# Altium project pay-motors-control.PrjPCB
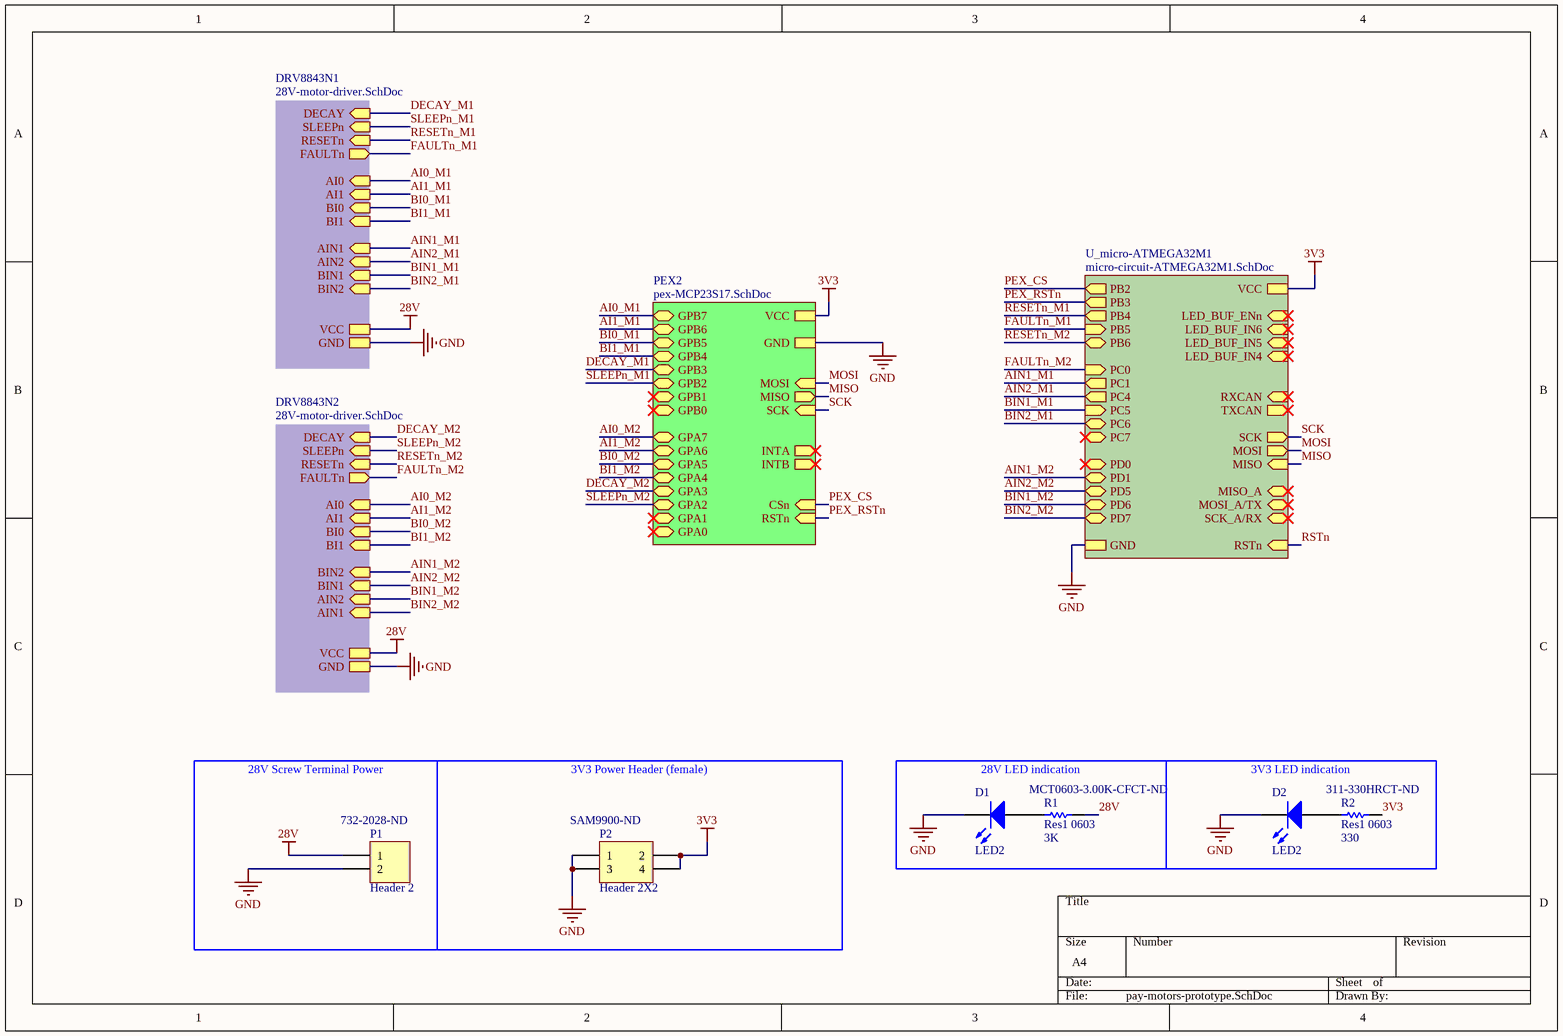
[diagram p0: pay-motors-prototype.SchDoc]
2 sheets, 42 parts. Net scope: hierarchical (ports join the sheet entries above them; power ports are global).
Board file: pay-motors-prototype.PcbDoc
Sheets:
  pay-motors-prototype.SchDoc
    DRV8843N1 = 28V-motor-driver.SchDoc
    DRV8843N2 = 28V-motor-driver.SchDoc

## Sheet pay-motors-prototype.SchDoc
size A4; DrawnBy: Lorna Lan; DocumentNumber: 1; Revision: V1; SheetNumber: 1; SheetTotal: 7

### Parts
D1  LED2  [0603-LED]
D2  LED2  [0603-LED]
P1  Header 2  Supplier Part Number 1: 732-2028-ND  [CON2_SCREW_5.00MM_691102710002]
P2  Header 2X2  Supplier Part Number 1: SAM9900-ND  [HDR2X2]
R1  Res1 0603  value 3K  Supplier Part Number 1: MCT0603-3.00K-CFCT-ND  [0603-RES]
R2  Res1 0603  value 330  Supplier Part Number 1: 311-330HRCT-ND  [0603-RES]

### Sub-sheets
DRV8843N1 = 28V-motor-driver.SchDoc: DECAY (in), GND, SLEEPn (in), BI1 (in), BI0 (in), RESETn (in), VCC, FAULTn (out), AI1 (in), AI0 (in), BIN2 (in), BIN1 (in), AIN2 (in), AIN1 (in)
DRV8843N2 = 28V-motor-driver.SchDoc: DECAY (in), GND, SLEEPn (in), BI1 (in), BI0 (in), RESETn (in), VCC, FAULTn (out), AI1 (in), AI0 (in), BIN2 (in), BIN1 (in), AIN2 (in), AIN1 (in)
PEX2 = pex-MCP23S17.SchDoc (file not in this document): RSTn (in), GPA0 (bidir), GPA6 (bidir), GPA1 (bidir), GPB2 (bidir), INTB (out), GPB1 (bidir), GPB3 (bidir), GPA5 (bidir), GND, GPA7 (bidir), GPB7 (bidir), MISO (out), GPB4 (bidir), INTA (out), GPB6 (bidir), GPA2 (bidir), VCC, GPA3 (bidir), GPB0 (bidir), MOSI (in), SCK (in), GPA4 (bidir), GPB5 (bidir), CSn (in)
U_micro-ATMEGA32M1 = micro-circuit-ATMEGA32M1.SchDoc (file not in this document): LED_BUF_IN6 (in), LED_BUF_IN5 (in), LED_BUF_IN4 (in), LED_BUF_ENn (in), PB5 (in), MOSI_A/TX (bidir), PB2 (out), MISO_A (bidir), RXCAN (in), TXCAN (out), PC0 (in), PB3 (out), PC1 (out), PC4 (out), PC5 (in), PC6 (bidir), PC7 (bidir), PD1 (bidir), PD5 (bidir), PD6 (bidir), PD7 (bidir), PD0 (bidir), PB4 (out), SCK (out), SCK_A/RX (bidir), MISO (in), MOSI (out), PB6 (bidir), RSTn (in), GND, VCC

### Nets
3V3: P2.2 P2.4 R2.2 ; sheet U_micro-ATMEGA32M1/VCC, sheet PEX2/VCC
28V: P1.1 R1.2 ; sheet DRV8843N1/VCC, sheet DRV8843N2/VCC
GND: D1.2(K) D2.2(K) P1.2 P2.1 P2.3 ; sheet U_micro-ATMEGA32M1/GND, sheet PEX2/GND, sheet DRV8843N1/GND, sheet DRV8843N2/GND
AI0_M1: sheet PEX2/GPB7, sheet DRV8843N1/AI0  [project net AI0_DRV8843N1]
AI0_M2: sheet PEX2/GPA7, sheet DRV8843N2/AI0  [project net AI0_DRV8843N2]
AI1_M1: sheet PEX2/GPB6, sheet DRV8843N1/AI1  [project net AI1_DRV8843N1]
AI1_M2: sheet PEX2/GPA6, sheet DRV8843N2/AI1  [project net AI1_DRV8843N2]
AIN1_M1: sheet U_micro-ATMEGA32M1/PC1, sheet DRV8843N1/AIN1  [project net AIN1_DRV8843N1]
AIN1_M2: sheet U_micro-ATMEGA32M1/PD1, sheet DRV8843N2/BIN2
AIN2_M1: sheet U_micro-ATMEGA32M1/PC4, sheet DRV8843N1/AIN2  [project net AIN2_DRV8843N1]
AIN2_M2: sheet U_micro-ATMEGA32M1/PD5, sheet DRV8843N2/BIN1
BI0_M1: sheet PEX2/GPB5, sheet DRV8843N1/BI0  [project net BI0_DRV8843N1]
BI0_M2: sheet PEX2/GPA5, sheet DRV8843N2/BI0  [project net BI0_DRV8843N2]
BI1_M1: sheet PEX2/GPB4, sheet DRV8843N1/BI1  [project net BI1_DRV8843N1]
BI1_M2: sheet PEX2/GPA4, sheet DRV8843N2/BI1  [project net BI1_DRV8843N2]
BIN1_M1: sheet U_micro-ATMEGA32M1/PC5, sheet DRV8843N1/BIN1  [project net BIN1_DRV8843N1]
BIN1_M2: sheet U_micro-ATMEGA32M1/PD6, sheet DRV8843N2/AIN2  [project net AIN2_DRV8843N2]
BIN2_M1: sheet U_micro-ATMEGA32M1/PC6, sheet DRV8843N1/BIN2  [project net BIN2_DRV8843N1]
BIN2_M2: sheet U_micro-ATMEGA32M1/PD7, sheet DRV8843N2/AIN1  [project net AIN1_DRV8843N2]
DECAY_M1: sheet PEX2/GPB3, sheet DRV8843N1/DECAY  [project net DECAY_DRV8843N1]
DECAY_M2: sheet PEX2/GPA3, sheet DRV8843N2/DECAY  [project net DECAY_DRV8843N2]
FAULTn_M1: sheet U_micro-ATMEGA32M1/PB5, sheet DRV8843N1/FAULTn  [project net FAULTn_DRV8843N1]
FAULTn_M2: sheet U_micro-ATMEGA32M1/PC0, sheet DRV8843N2/FAULTn  [project net FAULTn_DRV8843N2]
MISO: sheet U_micro-ATMEGA32M1/MISO, sheet PEX2/MISO
MOSI: sheet U_micro-ATMEGA32M1/MOSI, sheet PEX2/MOSI
PEX_CS: sheet U_micro-ATMEGA32M1/PB2, sheet PEX2/CSn
PEX_RSTn: sheet U_micro-ATMEGA32M1/PB3, sheet PEX2/RSTn
RESETn_M1: sheet U_micro-ATMEGA32M1/PB4, sheet DRV8843N1/RESETn  [project net RESETn_DRV8843N1]
RESETn_M2: sheet U_micro-ATMEGA32M1/PB6, sheet DRV8843N2/RESETn  [project net RESETn_DRV8843N2]
RSTn: sheet U_micro-ATMEGA32M1/RSTn
SCK: sheet U_micro-ATMEGA32M1/SCK, sheet PEX2/SCK
SLEEPn_M1: sheet PEX2/GPB2, sheet DRV8843N1/SLEEPn  [project net SLEEPn_DRV8843N1]
SLEEPn_M2: sheet PEX2/GPA2, sheet DRV8843N2/SLEEPn  [project net SLEEPn_DRV8843N2]
NetD1_1: D1.1(A) R1.1
NetD2_1: D2.1(A) R2.1

### Notes on the sheet
- 28V LED indication
- 3V3 LED indication
- (near P1) 28V Screw Terminal Power
- (near P2) 3V3 Power Header (female)

### Library data of the parts
D1 D2 = LED2: Typical RED, GREEN, YELLOW, AMBER GaAs LED; Published: 8-Jun-2000; LatestRevisionDate: 17-Jul-2002; LatestRevisionNote: Re-released for DXP Platform.; PackageVersion: Feb-2002; PackageReference: 3.2X1.6X1.1; Publisher: Altium Limited; PackageDescription: SM LED; 2 Flat Leads
P1 = Header 2: Header, 2-Pin; LatestRevisionDate: 17-Jul-2002; LatestRevisionNote: Re-released for DXP Platform.; Publisher: Altium Limited; Supplier 1: Digi-Key
P2 = Header 2X2: Header, 2-Pin, Dual row; LatestRevisionDate: 17-Jul-2002; LatestRevisionNote: Re-released for DXP Platform.; Publisher: Altium Limited; Supplier 1: Digi-Key
R1 R2 = Res1: Resistor; Published: 8-Jun-2000; LatestRevisionDate: 17-Jul-2002; LatestRevisionNote: Re-released for DXP Platform.; Publisher: Altium Limited; Supplier 1: Digi-Key
  R2: PackageReference: AXIAL-0.3; PackageDescription: Axial Device, Thru-Hole; 2 Leads; 0.3 in Pin Spacing; ComponentLink1Description: Digikey Link; ComponentLink1URL: https://www.digikey.ca/product-detail/en/yageo/RC0603FR-07330RL/311-330HRCT-ND/730109

## Sheet 28V-motor-driver.SchDoc
size A4; DrawnBy: Lorna Lan; DocumentNumber: 3; Revision: V1; SheetNumber: 4; SheetTotal: 7
Used 2 times, as channels DRV8843N1, DRV8843N2. Parts and nets are listed once, with the designators drawn on the sheet.
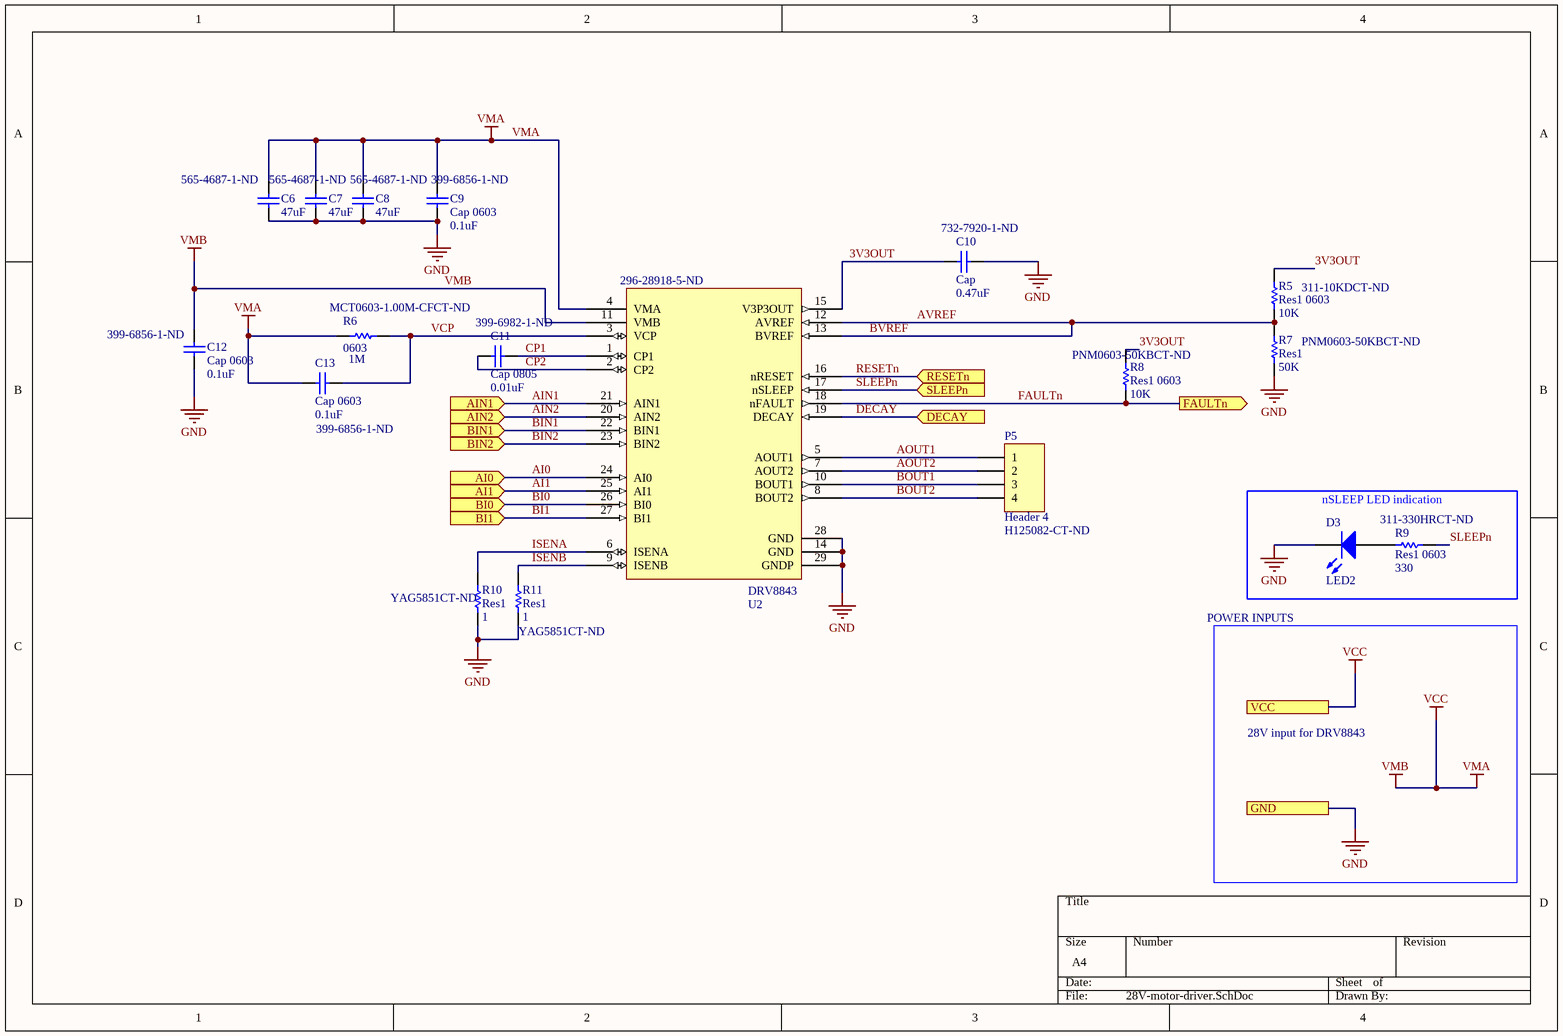
[diagram p1: 28V-motor-driver.SchDoc]

### Parts
C6  47uF  Supplier Part Number 1: 565-4687-1-ND  [CAP-2 J-lead]
C7  47uF  Supplier Part Number 1: 565-4687-1-ND  [CAP-2 J-lead]
C8  47uF  Supplier Part Number 1: 565-4687-1-ND  [CAP-2 J-lead]
C9  Cap 0603  value 0.1uF  Supplier Part Number 1: 399-6856-1-ND  [0603-RES]
C10  Cap  value 0.47uF  Supplier Part Number 1: 732-7920-1-ND  [0603-RES]
C11  Cap 0805  value 0.01uF  Supplier Part Number 2: 399-6982-1-ND  [6-0805_M]
C12  Cap 0603  value 0.1uF  Supplier Part Number 1: 399-6856-1-ND  [0603-RES]
C13  Cap 0603  value 0.1uF  Supplier Part Number 1: 399-6856-1-ND  [0603-RES]
D3  LED2  [0603-LED]
P5  Header 4  Supplier Part Number 1: H125082-CT-ND  [DF13A-4P-1.25H(51)]
R5  Res1 0603  value 10K  Supplier Part Number 1: 311-10KDCT-ND  [0603-RES]
R6  0603  value 1M  Supplier Part Number 1: MCT0603-1.00M-CFCT-ND  [0603-RES]
R7  Res1  value 50K  Supplier Part Number 1: PNM0603-50KBCT-ND  [0603-RES]
R8  Res1 0603  value 10K  Supplier Part Number 1: PNM0603-50KBCT-ND  [0603-RES]
R9  Res1 0603  value 330  Supplier Part Number 1: 311-330HRCT-ND  [0603-RES]
R10  Res1  value 1  Supplier Part Number 1: YAG5851CT-ND  [6-0805_M]
R11  Res1  value 1  Supplier Part Number 1: YAG5851CT-ND  [6-0805_M]
U2  DRV8843  Supplier Part Number 1: 296-28918-5-ND  [SOP65P640X110-29N]

### Ports
AI0 (in), AI1 (in), AIN1 (in), AIN2 (in), BI0 (in), BI1 (in), BIN1 (in), BIN2 (in), DECAY (in), FAULTn (out), GND, RESETn (in), SLEEPn (in), VCC

### Nets
GND: C6.2 C7.2 C8.2 C9.2 C10.2 C12.2 D3.2(K) R7.1 R10.2 R11.2 U2.14(GND) U2.28(GND) U2.29(GNDP) ; port GND
VMA: C6.1 C7.1 C8.1 C9.1 C12.1 C13.1 R6.1 U2.4(VMA) U2.11(VMB) ; port VCC  [also labelled VCC, VMB]
3V3OUT: C10.1 R5.2 R8.2 U2.15(V3P3OUT)
AI0: U2.24(AI0) ; port AI0
AI1: U2.25(AI1) ; port AI1
AIN1: U2.21(AIN1) ; port AIN1
AIN2: U2.20(AIN2) ; port AIN2
AOUT1: P5.1 U2.5(AOUT1)
AOUT2: P5.2 U2.7(AOUT2)
AVREF: R5.1 R7.2 U2.12(AVREF) U2.13(BVREF)  [also labelled BVREF]
BI0: U2.26(BI0) ; port BI0
BI1: U2.27(BI1) ; port BI1
BIN1: U2.22(BIN1) ; port BIN1
BIN2: U2.23(BIN2) ; port BIN2
BOUT1: P5.3 U2.10(BOUT1)
BOUT2: P5.4 U2.8(BOUT2)
CP1: C11.1 U2.1(CP1)
CP2: C11.2 U2.2(CP2)
DECAY: U2.19(DECAY) ; port DECAY
FAULTn: R8.1 U2.18(nFAULT) ; port FAULTn
ISENA: R10.1 U2.6(ISENA)
ISENB: R11.1 U2.9(ISENB)
RESETn: U2.16(nRESET) ; port RESETn
SLEEPn: R9.2 U2.17(nSLEEP) ; port SLEEPn
VCP: C13.2 R6.2 U2.3(VCP)
NetD3_1: D3.1(A) R9.1

### Channels
DRV8843N1: designators C6=BYPASS2 C7=C7_DRV8843N1 C8=C8_DRV8843N1 C9=C9#1 C10=C10#1 C11=C11#1 C12=C12#1 C13=C13#1 D3=M1_EN P5=M1 R5=R5#1 R6=R6#1 R7=R7#1 R8=R8#1 R9=R9#1 R10=ISENA#1 R11=ISENB#1 U2=DRV8843#1; ports AI0=AI0_DRV8843N1 AI1=AI1_DRV8843N1 AIN1=AIN1_DRV8843N1 AIN2=AIN2_DRV8843N1 BI0=BI0_DRV8843N1 BI1=BI1_DRV8843N1 BIN1=BIN1_DRV8843N1 BIN2=BIN2_DRV8843N1 DECAY=DECAY_DRV8843N1 FAULTn=FAULTn_DRV8843N1 GND=GND RESETn=RESETn_DRV8843N1 SLEEPn=SLEEPn_DRV8843N1 VCC=28V
DRV8843N2: designators C6=C6_DRV8843N2 C7=BYPASS3 C8=BYPASS1 C9=C9#2 C10=C10#2 C11=C11#2 C12=C12#2 C13=C13#2 D3=M2_EN P5=M2 R5=R5#2 R6=R6#2 R7=R7#2 R8=R8#2 R9=R9#2 R10=ISENA#2 R11=ISENB#2 U2=DRV8843#2; ports AI0=AI0_DRV8843N2 AI1=AI1_DRV8843N2 AIN1=AIN1_DRV8843N2 AIN2=AIN2_DRV8843N2 BI0=BI0_DRV8843N2 BI1=BI1_DRV8843N2 BIN1=AIN2_M2 BIN2=AIN1_M2 DECAY=DECAY_DRV8843N2 FAULTn=FAULTn_DRV8843N2 GND=GND RESETn=RESETn_DRV8843N2 SLEEPn=SLEEPn_DRV8843N2 VCC=28V

### Notes on the sheet
- POWER INPUTS
- nSLEEP LED indication
- 28V input for DRV8843

### Library data of the parts
C6-C8 = Cap: 47µF ±20% 50V Ceramic Capacitor X7R Stacked SMD, 2 J-Lead; Published: 8-Jun-2000; LatestRevisionDate: 17-Jul-2002; LatestRevisionNote: Re-released for DXP Platform.; PackageReference: RAD-0.3; Publisher: Altium Limited; PackageDescription: Radial Cap, Thru-Hole; 2 Leads; 0.3 in Pin Spacing; Value: 47uF; ComponentLink1Description: Digikey Link; ComponentLink1URL: https://www.digikey.ca/product-detail/en/united-chemi-con/KTJ500B476M76BFT00/565-4687-1-ND/6210741; Supplier 1: Digi-Key
C9 C12 C13 = Cap: Capacitor; Published: 8-Jun-2000; LatestRevisionDate: 17-Jul-2002; LatestRevisionNote: Re-released for DXP Platform.; PackageReference: RAD-0.3; Publisher: Altium Limited; PackageDescription: Radial Cap, Thru-Hole; 2 Leads; 0.3 in Pin Spacing; Supplier 1: Digi-Key
  C9 C12: ComponentLink1Description: Digikey Link; ComponentLink1URL: https://www.digikey.ca/product-detail/en/yageo/CC0603ZRY5V9BB104/311-1343-1-ND/2103127
C10 = Cap: Capacitor; Capacitance: 470nF; Voltage Rating: 6.3V; Tolerance: 10%; Published: 8-Jun-2000; LatestRevisionDate: 17-Jul-2002; LatestRevisionNote: Re-released for DXP Platform.; PackageReference: RAD-0.3; Publisher: Altium Limited; PackageDescription: Radial Cap, Thru-Hole; 2 Leads; 0.3 in Pin Spacing; Mount: Surface Mount; Case/Package: 0603; Case Code (Metric): 1608; Case Code (Imperial): 0603; Min Operating Temperature: -55°C; Max Operating Temperature: 125°C; Length: 0.063inch; Width: 0.031inch; Thickness: 0.037inch; Supplier 1: Digi-Key
C11 = Cap: Capacitor; Manufacturer: KEMET; Manufacturer Part Number: C0805F103K5RACAUTO; Dielectric Material: Ceramic; Capacitance: 10nF; Voltage Rating: 50V; Tolerance: 10%; Dielectric: X7R; Published: 8-Jun-2000; LatestRevisionDate: 17-Jul-2002; LatestRevisionNote: Re-released for DXP Platform.; PackageReference: RAD-0.3; Publisher: Altium Limited; PackageDescription: Radial Cap, Thru-Hole; 2 Leads; 0.3 in Pin Spacing; ComponentLink1Description: Digikey Link; ComponentLink1URL: https://www.digikey.ca/product-detail/en/yageo/CC0805KRX7R9BB103/311-1136-1-ND/303046; Supplier 1: Digi-Key; Supplier 2: Digi-Key; Stock 2: 15954; Pricing 2: 1=0.42, 10=0.292, 100=0.175, 500=0.13124, 1000=0.11082 (USD); Mount: Surface Mount; Case/Package: 0805; Case Code (Metric): 2012; Case Code (Imperial): 0805; Min Operating Temperature: -55°C; Max Operating Temperature: 125°C; Package Quantity: 4000; Packaging: Cut Tape; Voltage Rating (DC): 50V; Features: Soft Termination; Length: 0.079inch; Width: 0.049inch; Thickness: 0.039inch; Ratings: AEC-Q200; REACH SVHC: No SVHC
D3 = LED2: as D1 on sheet pay-motors-prototype; Published: 8-Jun-2000; LatestRevisionDate: 17-Jul-2002; LatestRevisionNote: Re-released for DXP Platform.; PackageVersion: Feb-2002; PackageReference: 3.2X1.6X1.1; Publisher: Altium Limited; PackageDescription: SM LED; 2 Flat Leads
P5 = Header 4: Header, 4-Pin; LatestRevisionDate: 17-Jul-2002; LatestRevisionNote: Re-released for DXP Platform.; Publisher: Altium Limited; Supplier 1: Digi-Key
R5 = Res1: Resistor; Manufacturer: Yageo; Manufacturer Part Number: RT0603DRD0710KL; Tolerance: 0.5%; Resistance: 10kR; Power Rating: 100mW; Temperature Coefficient: 25ppm/°C; Voltage Rating (DC): 50V; Published: 8-Jun-2000; LatestRevisionDate: 17-Jul-2002; LatestRevisionNote: Re-released for DXP Platform.; PackageReference: AXIAL-0.3; Publisher: Altium Limited; PackageDescription: Axial Device, Thru-Hole; 2 Leads; 0.3 in Pin Spacing; ComponentLink1Description: Digikey Link; ComponentLink1URL: https://www.digikey.ca/product-detail/en/yageo/RT0603DRD0710KL/311-10KDCT-ND/1035680; Supplier 1: Digi-Key; Stock 1: 521729; Pricing 1: 1=0.2, 10=0.167, 100=0.0651, 1000=0.02725, 2500=0.02498 (USD); Case/Package: 0603; Min Operating Temperature: -55°C; Max Operating Temperature: 125°C; Packaging: Tape and Reel; Composition: Thin Film; Military Standard: Not; Length: 1.6mm; Depth: 0.8mm; Width: 800um; Lead Free: Lead Free
R6-R11 = Res1: Resistor; Published: 8-Jun-2000; LatestRevisionDate: 17-Jul-2002; LatestRevisionNote: Re-released for DXP Platform.; PackageReference: AXIAL-0.3; Publisher: Altium Limited; PackageDescription: Axial Device, Thru-Hole; 2 Leads; 0.3 in Pin Spacing; ComponentLink1Description: Digikey Link; Supplier 1: Digi-Key
  R6: ComponentLink1URL: https://www.digikey.ca/product-detail/en/vishay-beyschlag/MCT06030C1004FP500/MCT0603-1.00M-CFCT-ND/2607877
  R7: ComponentLink1URL: https://www.digikey.ca/product-detail/en/vishay-thin-film/PNM0603E5002BST5/PNM0603-50KBCT-ND/2120388
  R8: ComponentLink1URL: https://www.digikey.ca/product-detail/en/yageo/RT0603DRD0710KL/311-10KDCT-ND/1035680
  R9: ComponentLink1URL: https://www.digikey.ca/product-detail/en/yageo/RC0603FR-07330RL/311-330HRCT-ND/730109
  R10 R11: ComponentLink1URL: https://www.digikey.ca/product-detail/en/yageo/SR0805FR-471RL/YAG5851CT-ND/9373236
U2 = DRV8843: Dual H-Bridge Driver, accept input voltages from 8.2V ~ 45V, with two-bit current control; Manufacturer: Texas Instruments; Manufacturer Part Number: DRV8843PWP; Output Current: 1.75A; Nominal Supply Current: 5mA; Number of Outputs: 4; Output Voltage: 3.3V; Motor Type: Stepper; Switching Frequency: 50kHz; Supplier 1: Digi-Key; Stock 1: 410; Pricing 1: 1=4.34, 10=3.896, 50=3.6832, 100=3.1922, 500=2.71742, 1000=2.2918, 2500=2.17721 (USD); Mount: Surface Mount; Case/Package: HTSSOP EP; Number of Pins: 28; Min Operating Temperature: -40°C; Max Operating Temperature: 85°C; Package Quantity: 50; Packaging: Rail/Tube; Max Supply Voltage: 45V; Min Supply Voltage: 8.2V; Max Collector Current: 1.75A; Collector Emitter Voltage (VCEO): 45V; Length: 9.8mm; Height: 1.05mm; Width: 4.5mm; Radiation Hardening: No; REACH SVHC: No SVHC; Lead Free: Lead Free; ComponentLink1URL: http://www.ti.com/lit/gpn/drv8843?src-supplier=Mouser; ComponentLink1Description: http://www.ti.com/lit/gpn/drv8843?src-supplier=Mouser; ComponentLink2URL: http://www.farnell.com/datasheets/2019060.pdf?src-supplier=Element14; ComponentLink2Description: http://www.farnell.com/datasheets/2019060.pdf?src-supplier=Element14; ComponentLink3URL: http://www.ti.com/lit/ds/symlink/drv8843.pdf?src-supplier=Avnet+Europe; ComponentLink3Description: http://www.ti.com/lit/ds/symlink/drv8843.pdf?src-supplier=Avnet+Europe; ComponentLink4URL: https://www.verical.com/server-webapp/html/getDatasheet?partID=393460&src-supplier=Verical; ComponentLink4Description: https://www.verical.com/server-webapp/html/getDatasheet?partID=393460&src-supplier=Verical; ComponentLink5URL: http://www.ti.com/general/docs/lit/getliterature.tsp?genericPartNumber=DRV8843&&fileType=pdf&src-supplier=Avnet; ComponentLink5Description: http://www.ti.com/general/docs/lit/getliterature.tsp?genericPartNumber=DRV8843&&fileType=pdf&src-supplier=Avnet; ComponentLink6URL: http://www.ti.com/lit/ds/symlink/drv8843.pdf?src-supplier=Digi-Key; ComponentLink6Description: http://www.ti.com/lit/ds/symlink/drv8843.pdf?src-supplier=Digi-Key

## Nets that join several sheets
28V: pay-motors-prototype (P1.1 R1.2), DRV8843N1 (9 pins), DRV8843N2 (9 pins)
GND: pay-motors-prototype (5 pins), DRV8843N1 (13 pins), DRV8843N2 (13 pins)